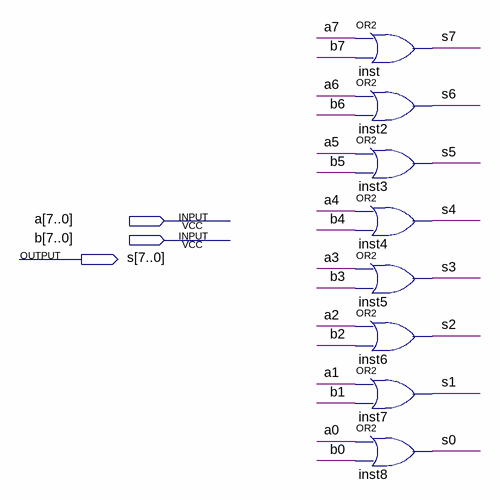
[diagram p0: schematic sheet]
// Quartus schematic ldm_or2_8bits.bdf as structural Verilog: 8 symbols, 3 pins
module ldm_or2_8bits (
  input  [7:0] a,
  input  [7:0] b,
  output [7:0] s
);

  or inst (s[7], a[7], b[7]);
  or inst2 (s[6], a[6], b[6]);
  or inst3 (s[5], a[5], b[5]);
  or inst4 (s[4], a[4], b[4]);
  or inst5 (s[3], a[3], b[3]);
  or inst6 (s[2], a[2], b[2]);
  or inst7 (s[1], a[1], b[1]);
  or inst8 (s[0], a[0], b[0]);
endmodule
